# EAGLE design tfpcmcia (EAGLE 9.6.2)
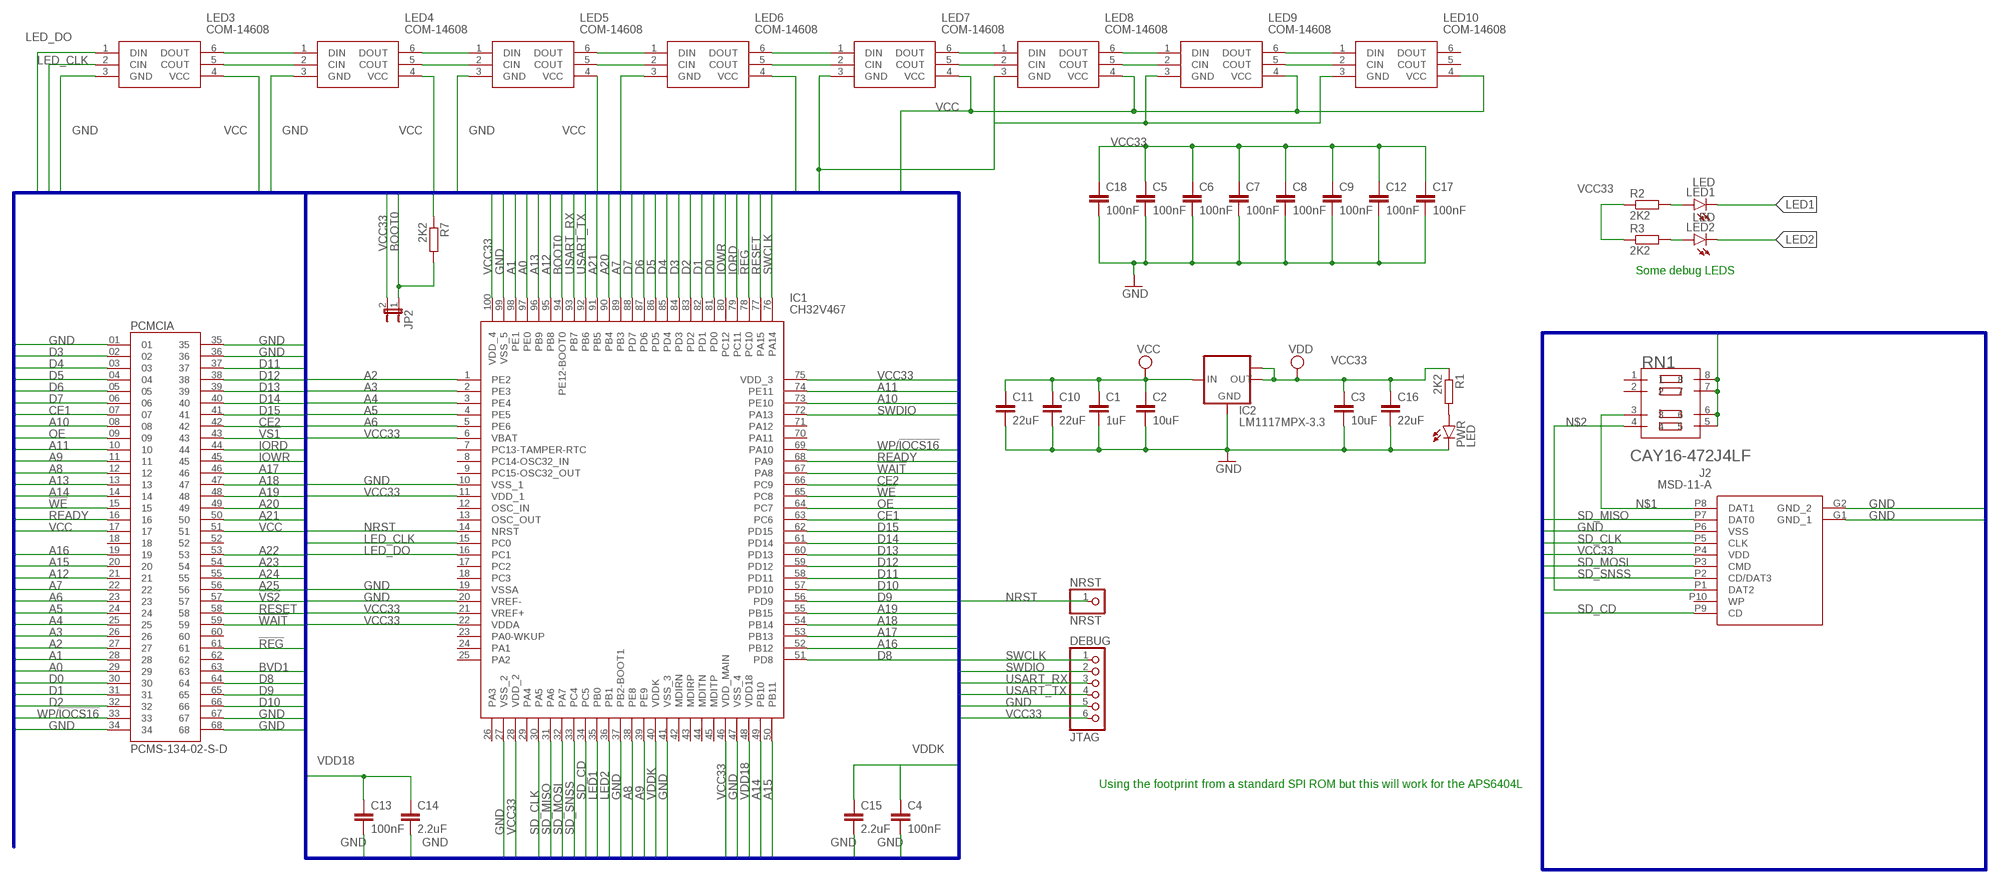
[diagram p0: schematic, sheet 1]

## Parts
C1  1uF  C-EUC1206  [C1206]
C2  10uF  CC0603  [C0603]
C3  10uF  C-EUC1206  [C1206]
C4  100nF  CC0603  [C0603]
C5  100nF  CC0603  [C0603]
C6  100nF  CC0603  [C0603]
C7  100nF  CC0603  [C0603]
C8  100nF  CC0603  [C0603]
C9  100nF  CC0603  [C0603]
C10  22uF  C-EUC1206  [C1206]
C11  22uF  C-EUC1206  [C1206]
C12  100nF  CC0603  [C0603]
C13  100nF  CC0603  [C0603]
C14  2.2uF  CC0603  [C0603]
C15  2.2uF  CC0603  [C0603]
C16  22uF  C-EUC1206  [C1206]
C17  100nF  CC0603  [C0603]
C18  100nF  CC0603  [C0603]
DEBUG  JTAG  HEADER-1X6ROUND  [1X06_ROUND]
IC1  CH32V467  CH32V467VET6  [QFP50P1600X1600X160-100N]
IC2  LM1117MPX-3.3  [SOT223]
J2  MSD-11-A  [MSD11A]
JP2  JUMPER-2PTH  [1X02]
LED1  LED  LEDSML0805  [SML0805]
LED2  LED  LEDSML0805  [SML0805]
LED3  COM-14608  [SON75P200X200X100-6N]
LED4  COM-14608  [SON75P200X200X100-6N]
LED5  COM-14608  [SON75P200X200X100-6N]
LED6  COM-14608  [SON75P200X200X100-6N]
LED7  COM-14608  [SON75P200X200X100-6N]
LED8  COM-14608  [SON75P200X200X100-6N]
LED9  COM-14608  [SON75P200X200X100-6N]
LED10  COM-14608  [SON75P200X200X100-6N]
NRST  NRST  PINHD-1X1  [1X01]
PCMCIA  PCMS-134-02-S-D  [SAMTEC_PCMS-134-02-S-D]
PWR  LED  LEDSML0805  [SML0805]
R1  2K2  R-EU_R0603  [R0603]
R2  2K2  R-EU_R0603  [R0603]
R3  2K2  R-EU_R0603  [R0603]
R7  2K2  R-EU_R0603  [R0603]
RN1  CAY16-472J4LF  CAY16-103J4LF  [RESCAXE80P320X160-8N]

## Nets
!REG: IC1.78(PC10) PCMCIA.61
!VS1: PCMCIA.43
!VS2: PCMCIA.57
!WAIT: IC1.67(PA8) PCMCIA.59
!WE: IC1.65(PC8) PCMCIA.15
A0: IC1.97(PE0) PCMCIA.29
A1: IC1.98(PE1) PCMCIA.28
A2: IC1.1(PE2) PCMCIA.27
A3: IC1.2(PE3) PCMCIA.26
A4: IC1.3(PE4) PCMCIA.25
A5: IC1.4(PE5) PCMCIA.24
A6: IC1.5(PE6) PCMCIA.23
A7: IC1.89(PB3) PCMCIA.22
A8: IC1.38(PE8) PCMCIA.12
A9: IC1.39(PE9) PCMCIA.11
A10: IC1.73(PE10) PCMCIA.08
A11: IC1.74(PE11) PCMCIA.10
A12: IC1.95(PB8) PCMCIA.21
A13: IC1.96(PB9) PCMCIA.13
A14: IC1.49(PB10) PCMCIA.14
A15: IC1.50(PB11) PCMCIA.20
A16: IC1.52(PB12) PCMCIA.19
A17: IC1.53(PB13) PCMCIA.46
A18: IC1.54(PB14) PCMCIA.47
A19: IC1.55(PB15) PCMCIA.48
A20: IC1.90(PB4) PCMCIA.49
A21: IC1.91(PB5) PCMCIA.50
A22: PCMCIA.53
A23: PCMCIA.54
A24: PCMCIA.55
A25: PCMCIA.56
BOOT0: IC1.94(PE12-BOOT0) JP2.1 R7.2
BVD1: PCMCIA.63
CE1: IC1.63(PC6) PCMCIA.07
CE2: IC1.66(PC9) PCMCIA.42
D0: IC1.81(PD0) PCMCIA.30
D1: IC1.82(PD1) PCMCIA.31
D2: IC1.83(PD2) PCMCIA.32
D3: IC1.84(PD3) PCMCIA.02
D4: IC1.85(PD4) PCMCIA.03
D5: IC1.86(PD5) PCMCIA.04
D6: IC1.87(PD6) PCMCIA.05
D7: IC1.88(PD7) PCMCIA.06
D8: IC1.51(PD8) PCMCIA.64
D9: IC1.56(PD9) PCMCIA.65
D10: IC1.57(PD10) PCMCIA.66
D11: IC1.58(PD11) PCMCIA.37
D12: IC1.59(PD12) PCMCIA.38
D13: IC1.60(PD13) PCMCIA.39
D14: IC1.61(PD14) PCMCIA.40
D15: IC1.62(PD15) PCMCIA.41
GND: C1.2 C2.2 C3.2 C4.2 C5.2 C6.2 C7.2 C8.2 C9.2 C10.2 C11.2 C12.2 C13.2 C14.2 C15.2 C16.2 C17.2 C18.2 DEBUG.5 IC1.10(VSS_1) IC1.19(VSSA) IC1.20(VREF-) IC1.27(VSS_2) IC1.37(PB2-BOOT1) IC1.41(VSS_3) IC1.47(VSS_4) IC1.99(VSS_5) IC2.1(GND) J2.G1(GND_1) J2.G2(GND_2) J2.P6(VSS) LED3.3(GND) LED4.3(GND) LED5.3(GND) LED6.3(GND) LED7.3(GND) LED8.3(GND) LED9.3(GND) LED10.3(GND) PCMCIA.01 PCMCIA.34 PCMCIA.35 PCMCIA.36 PCMCIA.67 PCMCIA.68 PWR.C R7.1
IORD: IC1.79(PC11) PCMCIA.44
IOWR: IC1.80(PC12) PCMCIA.45
LED1: IC1.35(PB0) LED1.C
LED2: IC1.36(PB1) LED2.C
LED_CLK: IC1.15(PC0) LED3.2(CIN)
LED_DO: IC1.16(PC1) LED3.1(DIN)
N$1: J2.P8(DAT1) RN1.3
N$2: J2.P1(DAT2) RN1.4
N$3: LED9.5(COUT) LED10.2(CIN)
N$4: LED9.6(DOUT) LED10.1(DIN)
N$5: LED1.A R2.2
N$6: LED2.A R3.2
N$11: LED4.5(COUT) LED5.2(CIN)
N$12: LED4.6(DOUT) LED5.1(DIN)
N$13: LED5.6(DOUT) LED6.1(DIN)
N$14: LED5.5(COUT) LED6.2(CIN)
N$15: LED3.5(COUT) LED4.2(CIN)
N$16: LED3.6(DOUT) LED4.1(DIN)
N$17: LED6.5(COUT) LED7.2(CIN)
N$18: PWR.A R1.2
N$19: LED6.6(DOUT) LED7.1(DIN)
N$20: LED7.6(DOUT) LED8.1(DIN)
N$21: LED7.5(COUT) LED8.2(CIN)
N$22: LED8.5(COUT) LED9.2(CIN)
N$23: LED8.6(DOUT) LED9.1(DIN)
NRST: IC1.14(NRST) NRST.1
OE: IC1.64(PC7) PCMCIA.09
READY: IC1.68(PA9) PCMCIA.16
RESET: IC1.77(PA15) PCMCIA.58
SD_CD: IC1.34(PC5) J2.P9(CD)
SD_CLK: IC1.30(PA5) J2.P5(CLK)
SD_MISO: IC1.31(PA6) J2.P7(DAT0)
SD_MOSI: IC1.32(PA7) J2.P3(CMD)
SD_SNSS: IC1.33(PC4) J2.P2(CD/DAT3)
SWCLK: DEBUG.1 IC1.76(PA14)
SWDIO: DEBUG.2 IC1.72(PA13)
USART_RX: DEBUG.3 IC1.93(PB7)
USART_TX: DEBUG.4 IC1.92(PB6)
VCC: C1.1 C2.1 C10.1 C11.1 IC2.3(IN) LED3.4(VCC) LED4.4(VCC) LED5.4(VCC) LED6.4(VCC) LED7.4(VCC) LED8.4(VCC) LED9.4(VCC) LED10.4(VCC) PCMCIA.17 PCMCIA.51
VCC33: C3.1 C5.1 C6.1 C7.1 C8.1 C9.1 C12.1 C16.1 C17.1 C18.1 DEBUG.6 IC1.6(VBAT) IC1.11(VDD_1) IC1.21(VREF+) IC1.22(VDDA) IC1.28(VDD_2) IC1.46(VDD_MAIN) IC1.75(VDD_3) IC1.100(VDD_4) IC2.2(OUT) IC2.TAB(OUT1) J2.P4(VDD) JP2.2 R1.1 R2.1 R3.1 RN1.5 RN1.6 RN1.7 RN1.8 ; supply symbol labelled VDD
VDD18: C13.1 C14.1 IC1.48(VDD18)
VDDK: C4.1 C15.1 IC1.40(VDDK)
WP/!IOCS16: IC1.69(PA10) PCMCIA.33
Unconnected: IC1.7(PC13-TAMPER-RTC) IC1.8(PC14-OSC32_IN) IC1.9(PC15-OSC32_OUT) IC1.12(OSC_IN) IC1.13(OSC_OUT) IC1.17(PC2) IC1.18(PC3) IC1.23(PA0-WKUP) IC1.24(PA1) IC1.25(PA2) IC1.26(PA3) IC1.29(PA4) IC1.42(MDIRN) IC1.43(MDIRP) IC1.44(MDITN) IC1.45(MDITP) IC1.70(PA11) IC1.71(PA12) J2.P10(WP) LED10.5(COUT) LED10.6(DOUT) PCMCIA.18 PCMCIA.52 PCMCIA.60 PCMCIA.62 RN1.1 RN1.2

## Buses
A[0..31],BVD[1..2],CD[1..2],CE[1..2],D[0..15],GND,IORD,IOWR,LED[1..3],LED_CLK,LED_DO,NRST,OE,RAM_CLK,RAM_MISO,RAM_MOSI,RAM_SNSS,READY,!REG,RESET,SD_CD,SD_CLK,SD_MISO,SD_MOSI,SD_SNSS,SWCLK,SWDIO,USART_RX,USART_TX,VCC,VCC33,!VS[1..2],!WAIT,!WE,WP/!IOCS16
AUD_MIXED,AUD_O,GND,SD_CD,SD_CLK,SD_MISO,SD_MOSI,SD_SNSS,VCC,VCC33
A[0..31],AUD_MIXED,AUD_O,BOOT0,BVD[1..2],CD[1..2],CE[1..2],D[0..15],GND,IORD,IOWR,LED[1..3],LED_CLK,LED_DO,NRST,OE,RAM_CLK,RAM_MISO,RAM_MOSI,RAM_SNSS,READY,!REG,RESET,SD_CD,SD_CLK,SD_MISO,SD_MOSI,SD_SNSS,SWCLK,SWDIO,USART_RX,USART_TX,USB1_DM,USB1_DP,VCC,VCC33,VDD18,VDDK,!VS[1..2],!WAIT,!WE,WP/!IOCS16

## Notes on the sheet
- Some debug LEDS
- Using the footprint from a standard SPI ROM but this will work for the APS6404L

## Library data of the parts
C1 C3 C10 C11 C16 = rcl:C-EU: CAPACITOR, European symbol; SPICEPREFIX: C
C2 C4-C9 C12-C15 C17 C18 = eagle-ltspice:C: CAPACITOR, European symbol; SPICEMODEL: NONE; SPICEPREFIX: C
DEBUG = microbuilder:HEADER-1X6: PIN HEADER
IC1 = SamacSys_Parts:CH32V467VET6: RISC-V QingKe 32-bit MCU, 200MHz, 992KB Flash, 200KB SRAM, 8MB on-chip PSRAM (mapped at 0x80000000), 2x USB2.0 HS, Ethernet MAC+PHY, FSMC, SDIO, 3x SPI, 10x USART Pin assignment from CH32V407/V467 Datasheet V1.2, Table 2-1 (CH32V467VET6 column). Note: PE7, PE13, PE14 and PE15 are NOT bonded out on this package. Pin 48 is VDD18 (on-chip PSRAM 1.8V rail, 0.1uF || 2.2uF). VDD_MAIN (pin 46) is the main VDD and needs 0.1uF || 10uF. Source: WCH <https://www.wch-ic.com/>; DESCRIPTION: RISC-V QingKe 32-bit MCU, 200MHz, 992KB Flash, 200KB SRAM, 8MB on-chip PSRAM (mapped at 0x80000000), 2x USB2.0 HS, Ethernet MAC+PHY, FSMC, SDIO, 3x SPI, 10x USART; HEIGHT: 1.6mm; MANUFACTURER_NAME: WCH; MANUFACTURER_PART_NUMBER: CH32V467VET6
IC2 = lm1117:LM1117MPX-*
J2 = SamacSys_Parts:MSD-11-A: Micro SD Card Connector, 8 Positions, Connector and Ejector, Push In, Auto Eject Out, Surface Mount, 1.85 mm Heaight Above Board, Gold Flash Source: Datasheet <https://www.sameskydevices.com/product/resource/msd-11-a.pdf>; DESCRIPTION: Micro SD Card Connector, 8 Positions, Connector and Ejector, Push In, Auto Eject Out, Surface Mount, 1.85 mm Heaight Above Board, Gold Flash; HEIGHT: 2.05mm; MANUFACTURER_NAME: Same Sky; MANUFACTURER_PART_NUMBER: MSD-11-A; MOUSER_PART_NUMBER: 179-MSD-11-A; MOUSER_PRICE-STOCK: https://www.mouser.co.uk/ProductDetail/Same-Sky/MSD-11-A?qs=Z%252BL2brAPG1Ik3z2e2QtVog%3D%3D
JP2 = SparkFun-Retired:JUMPER-2: Jumper Basic 0.1" spaced jumper. Use with breakaway headers.
LED1 LED2 PWR = led:LED: LED OSRAM: - CHIPLED LG R971, LG N971, LY N971, LG Q971, LY Q971, LO R971, LY R971 LH N974, LH R974 LS Q976, LO Q976, LY Q976 LO Q996 - Hyper CHIPLED LW Q18S LB Q993, LB Q99A, LB R99A - SideLED LS A670, LO A670, LY A670, LG A670, LP A670 LB A673, LV A673, LT A673, LW A673 LH A674 LY A675 LS A676, LA A676, LO A676, LY A676, LW A676 LS A679, LY A679, LG A679 - Hyper Micro SIDELED® LS Y876, LA Y876, LO Y876, LY Y876 LT Y87S - SmartLED LW L88C, LW L88S LB L89C, LB L89S, LG L890 LS L89K, LO L89K, LY L89K LS L896, LA L896, LO L896, LY L896 - TOPLED LS T670, LO T670, LY T670, LG T670, LP T670 LSG T670, LSP T670, LSY T670, LOP T670, LYG T670 LG T671, LOG T671, LSG T671 LB T673, LV T673, LT T673, LW T673 LH T674 LS T676, LA T676, LO T676, LY T676, LB T676, LH T676, LSB T676, LW T676 LB T67C, LV T67C, LT T67C, LS T67K, LO T67K, LY T67K, LW E67C LS E67B, LA E67B, LO E67B, LY E67B, LB E67C, LV E67C, LT E67C LW T67C LS T679, LY T679, LG T679 LS T770, LO T770, LY T770, LG T770, LP T770 LB T773, LV T773, LT T773, LW T773 LH T774 LS E675, LA E675, LY E675, LS T675 LS T776, LA T776, LO T776, LY T776, LB T776 LHGB T686 LT T68C, LB T68C - Hyper Mini TOPLED® LB M676 - Mini TOPLED Santana® LG M470 LS M47K, LO M47K, LY M47K Source: http://www.osram.convergy.de LUXEON: - LUMILED® LXK2-PW12-R00, LXK2-PW12-S00, LXK2-PW14-U00, LXK2-PW14-V00 LXK2-PM12-R00, LXK2-PM12-S00, LXK2-PM14-U00 LXK2-PE12-Q00, LXK2-PE12-R00, LXK2-PE12-S00, LXK2-PE14-T00, LXK2-PE14-U00 LXK2-PB12-K00, LXK2-PB12-L00, LXK2-PB12-M00, LXK2-PB14-N00, LXK2-PB14-P00, LXK2-PB14-Q00 LXK2-PR12-L00, LXK2-PR12-M00, LXK2-PR14-Q00, LXK2-PR14-R00 LXK2-PD12-Q00, LXK2-PD12-R00, LXK2-PD12-S00 LXK2-PH12-R00, LXK2-PH12-S00 LXK2-PL12-P00, LXK2-PL12-Q00, LXK2-PL12-R00 Source: www.luxeon.com KINGBRIGHT: KA-3528ASYC Source: www.kingbright.com
LED3-LED10 = Blinkenlights:COM-14608: SparkFun Accessories SMD LED - RGB APA102-2020 Source: Datasheet <https://componentsearchengine.com/Datasheets/1/COM-14608.pdf>; ARROW_PART_NUMBER: COM-14608; ARROW_PRICE-STOCK: https://www.arrow.com/en/products/com-14608/sparkfun-electronics?region=nac; DESCRIPTION: SparkFun Accessories SMD LED - RGB APA102-2020; HEIGHT: 1mm; MANUFACTURER_NAME: SparkFun; MANUFACTURER_PART_NUMBER: COM-14608; MOUSER_PART_NUMBER: 474-COM-14608; MOUSER_PRICE-STOCK: https://www.mouser.co.uk/ProductDetail/SparkFun/COM-14608?qs=r5DSvlrkXmJkrH4K3yuA0g%3D%3D
NRST = pinhead:PINHD-1X1: PIN HEADER
PCMCIA = PCMS-134-02-S-D:PCMS-134-02-S-D: Check availability <https://pricing.snapeda.com/parts/PCMS-134-02-S-D/Samtec/view-part?ref=eda>; AVAILABILITY: In Stock; CHECK_PRICES: https://www.snapeda.com/parts/PCMS-134-02-S-D/Samtec/view-part/?ref=eda; DESCRIPTION: Conn PCMCIA SKT 68 POS 1.27mm Solder ST Edge Mount 1A/Contact Tube; MF: Samtec; MP: PCMS-134-02-S-D; PACKAGE: None; PRICE: None; SNAPEDA_LINK: https://www.snapeda.com/parts/PCMS-134-02-S-D/Samtec/view-part/?ref=snap
R1-R3 R7 = rcl:R-EU_: RESISTOR, European symbol; SPICEPREFIX: R
RN1 = CAY16-103J4LF:CAY16-103J4LF: Res Thick Film Array 10K Ohm 5% 200ppm/C ISOL Molded 8-Pin 1206(4 X 0603) Convex SMD Paper T/R; AVAILABILITY: Good; DESCRIPTION: Res Thick Film Array 10K Ohm 5% ?200ppm/C ISOL Molded 8-Pin 1206(4 X 0603) Convex SMD Paper T/R; MF: Bourns; MP: CAY16-103J4LF; PACKAGE: 1206 Bourns; PRICE: 0.02 USD

## Board
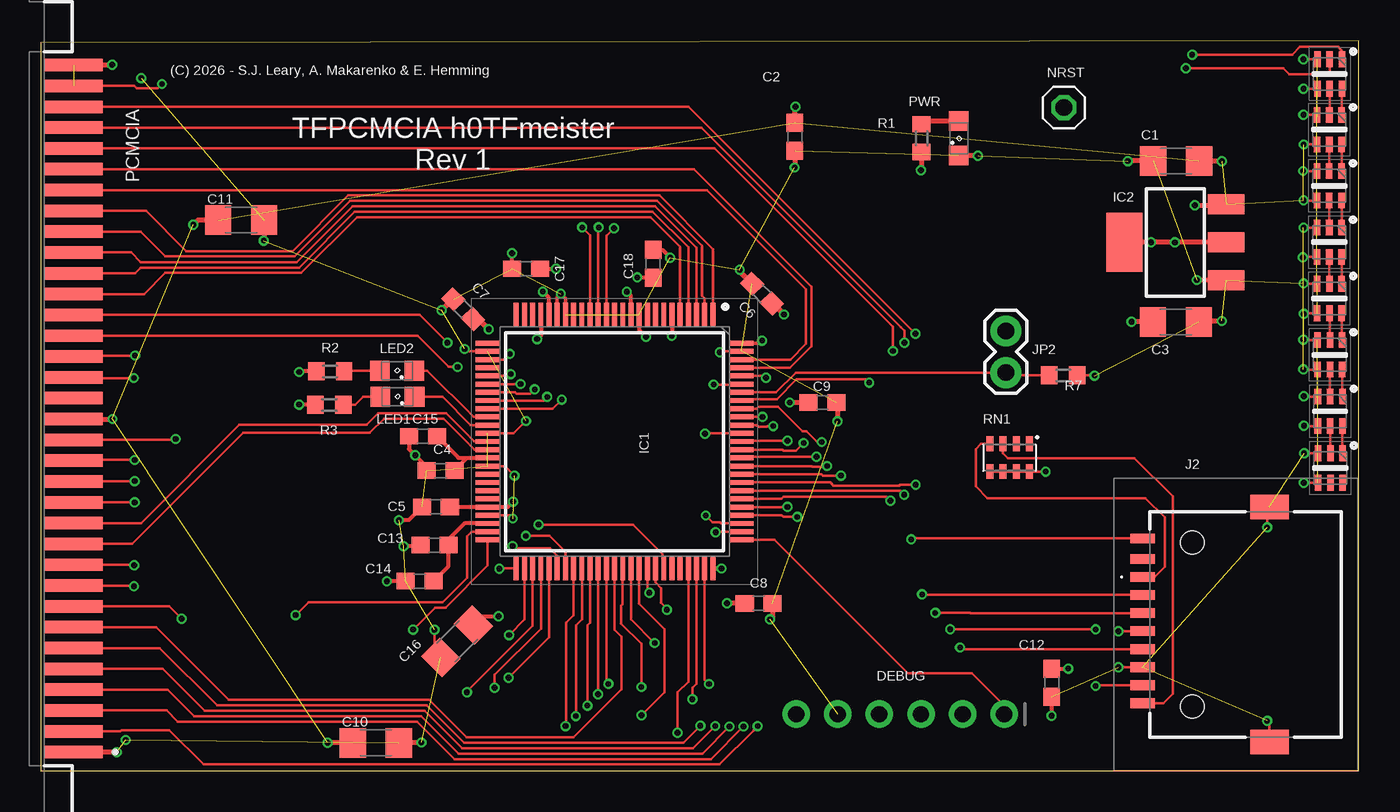
[diagram p1: board, top side]
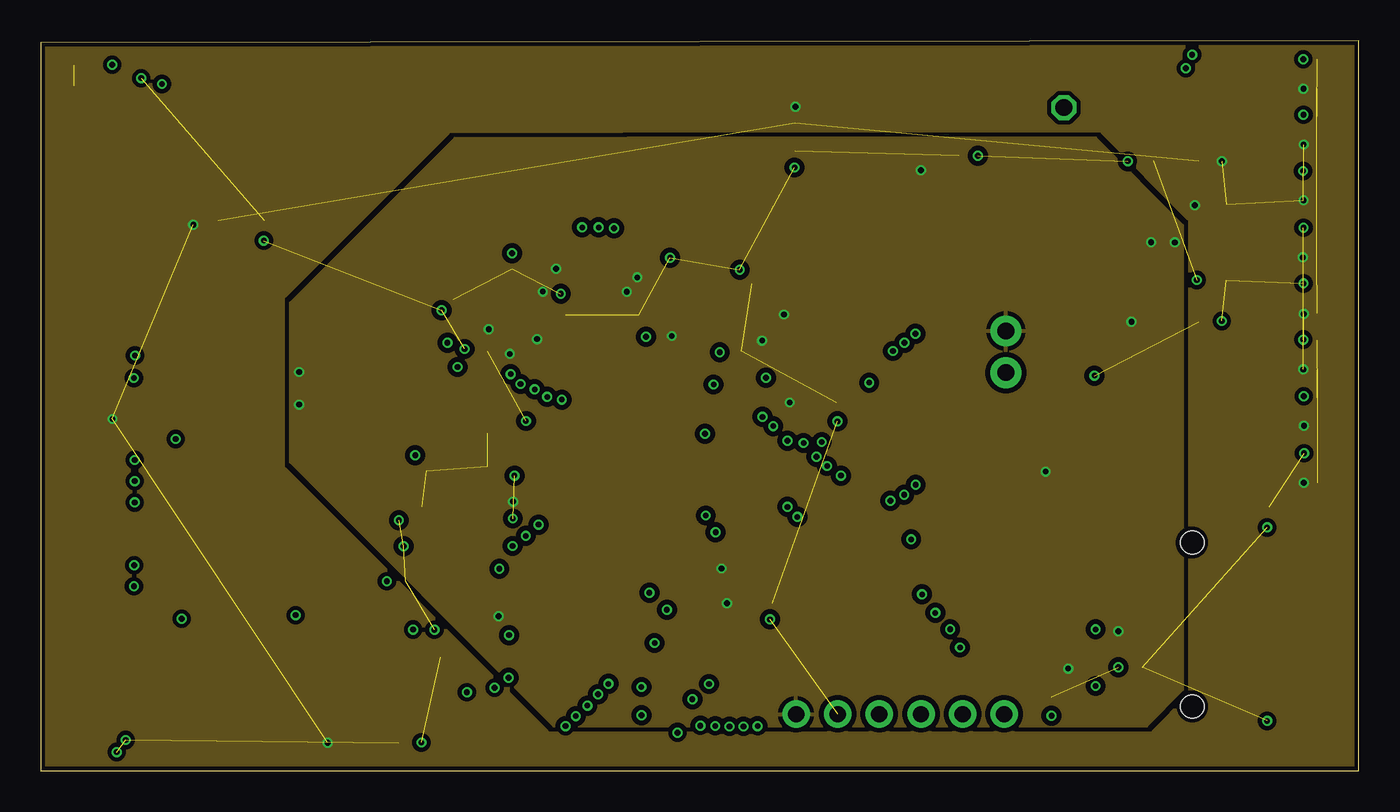
[diagram p2: board, inner layer PWR]
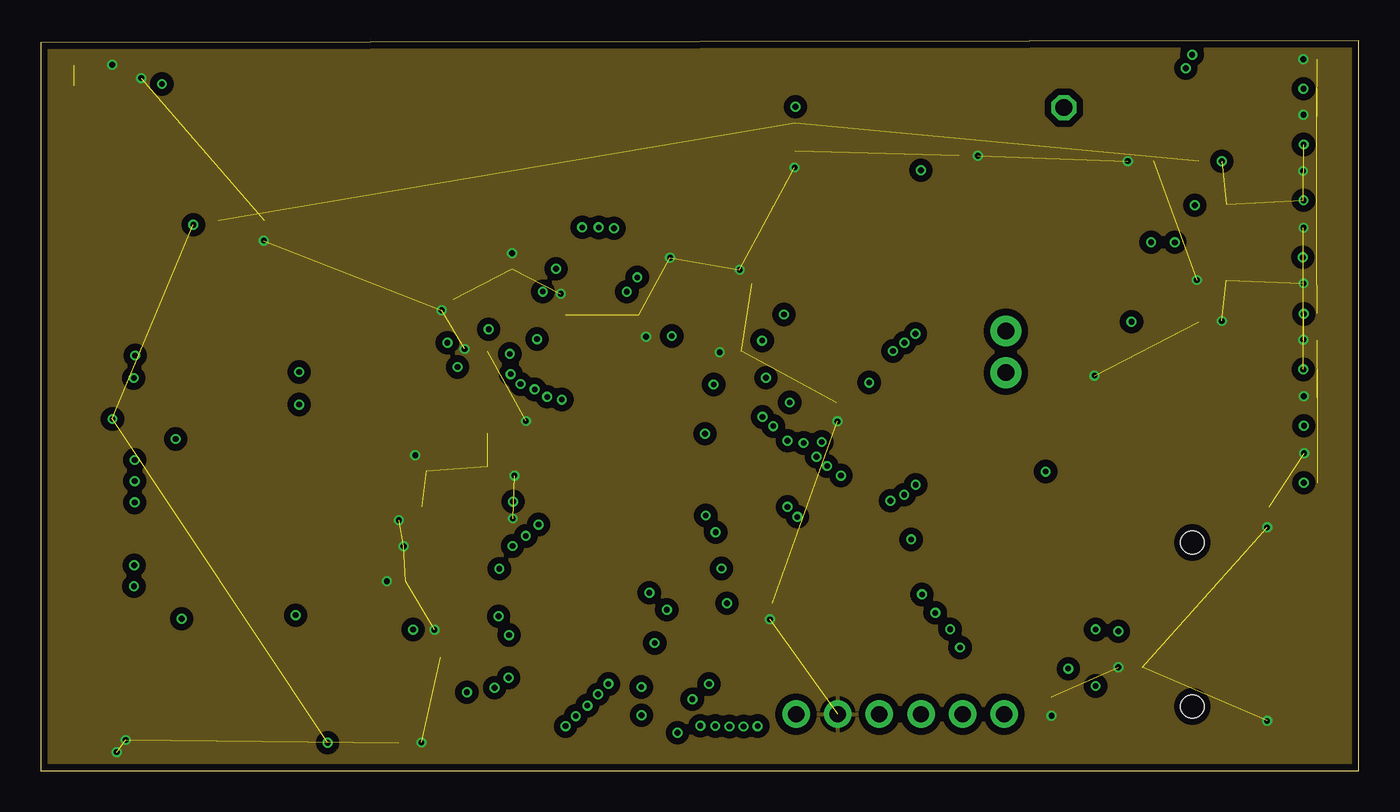
[diagram p3: board, inner layer GND]
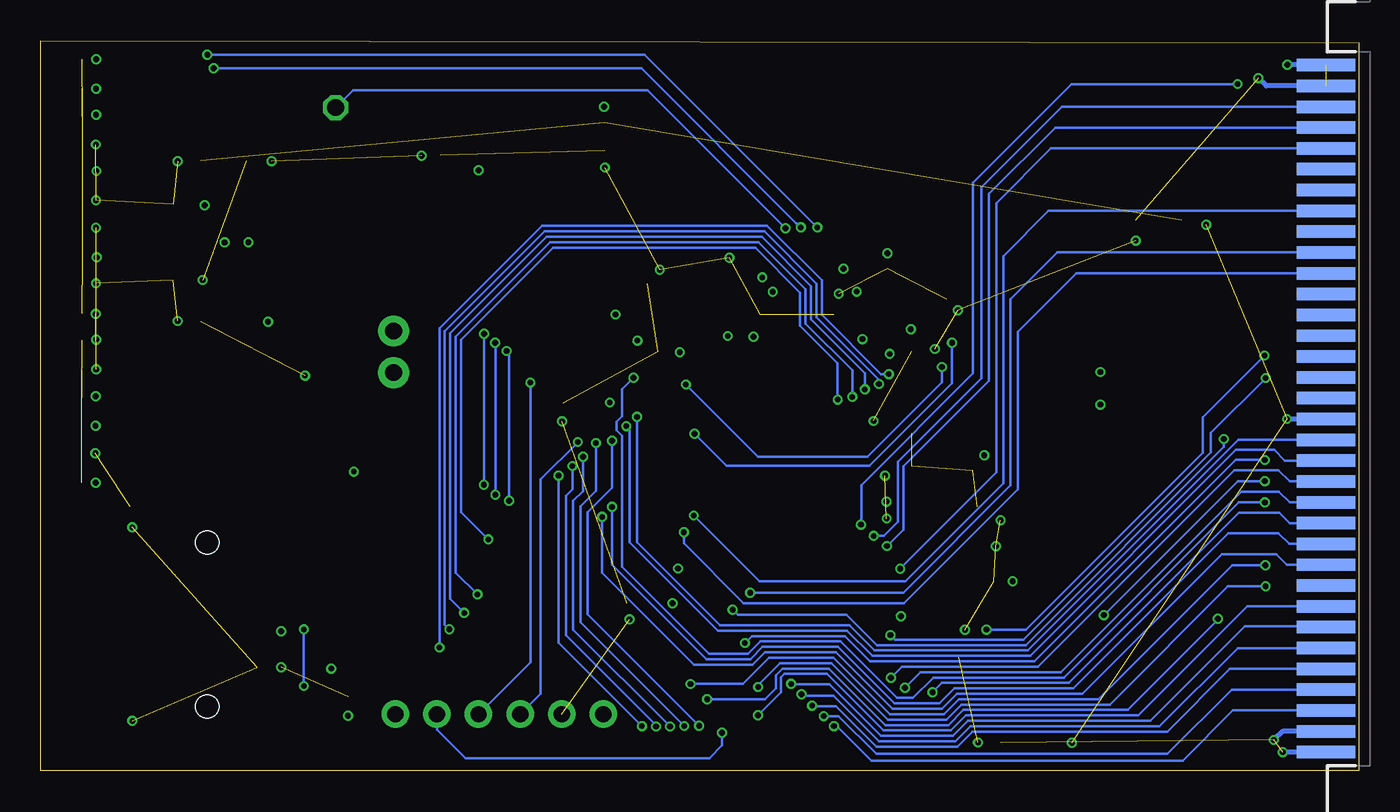
[diagram p4: board, bottom side, seen from below]

Size 80.41 x 44.52 mm. Coordinates in mm from the lower left corner, seen from the top.
Outline: 0,0 80.41,0 80.41,44.52 0,44.41 0,0
Copper layers (1*2*15*16): Top 0.035559375mm / dielectric 1.501140625mm / PWR 0.035559375mm / dielectric 0.149859375mm / GND 0.035559375mm / dielectric 0.200659375mm / Bottom 0.035559375mm
Design rules "jlcpcb-4layer *": minimum track width 5mil, minimum drill 0.2mm, track to track 7mil, track to pad 8mil, pad to pad 7mil, via to via 10mil, smd to smd 0mil, copper to edge 0.2mm, drill to drill 10mil, minimum pad ring 3mil, minimum via ring 5mil, stop-mask expansion 3mil, vias tented up to drill 0.2mm, thermal gap 10mil

### Footprints (pad centres in the part's own frame; a part is rotated, then mirrored left to right if it is on the bottom)
C1206 = smd 1.6 x 1.8: 1 -1.4,0; 2 1.4,0
C0603 = smd 1.1 x 1: 1 -0.85,0; 2 0.85,0
1X06_ROUND = drill 1 pad 1.676: 1 -6.35,0; 2 -3.81,0; 3 -1.27,0; 4 1.27,0; 5 3.81,0; 6 6.35,0
QFP50P1600X1600X160-100N = smd 1.475 x 0.3: 1 -7.738,6; 2 -7.738,5.5; 3 -7.738,5; 4 -7.738,4.5; 5 -7.738,4; 6 -7.738,3.5; 7 -7.738,3; 8 -7.738,2.5; 9 -7.738,2; 10 -7.738,1.5; 11 -7.738,1; 12 -7.738,0.5; 13 -7.738,0; 14 -7.738,-0.5; 15 -7.738,-1; 16 -7.738,-1.5; 17 -7.738,-2; 18 -7.738,-2.5; 19 -7.738,-3; 20 -7.738,-3.5; 21 -7.738,-4; 22 -7.738,-4.5; 23 -7.738,-5; 24 -7.738,-5.5; 25 -7.738,-6; 51 7.738,-6; 52 7.738,-5.5; 53 7.738,-5; 54 7.738,-4.5; 55 7.738,-4; 56 7.738,-3.5; 57 7.738,-3; 58 7.738,-2.5; 59 7.738,-2; 60 7.738,-1.5; 61 7.738,-1; 62 7.738,-0.5; 63 7.738,0; 64 7.738,0.5; 65 7.738,1; 66 7.738,1.5; 67 7.738,2; 68 7.738,2.5; 69 7.738,3; 70 7.738,3.5; 71 7.738,4; 72 7.738,4.5; 73 7.738,5; 74 7.738,5.5; 75 7.738,6 | smd 0.3 x 1.475: 26 -6,-7.738; 27 -5.5,-7.738; 28 -5,-7.738; 29 -4.5,-7.738; 30 -4,-7.738; 31 -3.5,-7.738; 32 -3,-7.738; 33 -2.5,-7.738; 34 -2,-7.738; 35 -1.5,-7.738; 36 -1,-7.738; 37 -0.5,-7.738; 38 0,-7.738; 39 0.5,-7.738; 40 1,-7.738; 41 1.5,-7.738; 42 2,-7.738; 43 2.5,-7.738; 44 3,-7.738; 45 3.5,-7.738; 46 4,-7.738; 47 4.5,-7.738; 48 5,-7.738; 49 5.5,-7.738; 50 6,-7.738; 76 6,7.738; 77 5.5,7.738; 78 5,7.738; 79 4.5,7.738; 80 4,7.738; 81 3.5,7.738; 82 3,7.738; 83 2.5,7.738; 84 2,7.738; 85 1.5,7.738; 86 1,7.738; 87 0.5,7.738; 88 0,7.738; 89 -0.5,7.738; 90 -1,7.738; 91 -1.5,7.738; 92 -2,7.738; 93 -2.5,7.738; 94 -3,7.738; 95 -3.5,7.738; 96 -4,7.738; 97 -4.5,7.738; 98 -5,7.738; 99 -5.5,7.738; 100 -6,7.738
SOT223 = smd 1.219 x 2.235: 1 -2.311,-3.099; 2 0,-3.099; 3 2.311,-3.099 | smd 3.6 x 2.2: TAB 0,3.099
MSD11A = smd 1.5 x 2.34: G1 7.17,-1.675; G2 -7.17,-1.675 | smd 0.6 x 1.5: P1 2.9,6.075; P2 1.8,6.075; P3 0.7,6.075; P4 -0.4,6.075; P5 -1.5,6.075; P6 -2.6,6.075; P7 -3.7,6.075; P8 -4.8,6.075; P9 5.25,6.075; P10 4,6.075 | hole 1.4: 5,3.025; -5,3.025
1X02 = drill 1.016 pad 1.88: 1 0,0; 2 2.54,0
SML0805 = smd 1.2 x 1.2: A 1.05,0; C -1.05,0
SON75P200X200X100-6N = smd 0.95 x 0.4: 1 -0.9,0.75; 2 -0.9,0; 3 -0.9,-0.75; 4 0.9,-0.75; 5 0.9,0; 6 0.9,0.75
1X01 = drill 1.016 octagon: 1 0,0
SAMTEC_PCMS-134-02-S-D = smd 0.762 x 3.556: 01 20.955,1.778; 02 19.685,1.778; 03 18.415,1.778; 04 17.145,1.778; 05 15.875,1.778; 06 14.605,1.778; 07 13.335,1.778; 08 12.065,1.778; 09 10.795,1.778; 10 9.525,1.778; 11 8.255,1.778; 12 6.985,1.778; 13 5.715,1.778; 14 4.445,1.778; 15 3.175,1.778; 16 1.905,1.778; 17 0.635,1.778; 18 -0.635,1.778; 19 -1.905,1.778; 20 -3.175,1.778; 21 -4.445,1.778; 22 -5.715,1.778; 23 -6.985,1.778; 24 -8.255,1.778; 25 -9.525,1.778; 26 -10.795,1.778; 27 -12.065,1.778; 28 -13.335,1.778; 29 -14.605,1.778; 30 -15.875,1.778; 31 -17.145,1.778; 32 -18.415,1.778; 33 -19.685,1.778; 34 -20.955,1.778 | smd 0.762 x 3.556 bottom: 35 20.955,1.778; 36 19.685,1.778; 37 18.415,1.778; 38 17.145,1.778; 39 15.875,1.778; 40 14.605,1.778; 41 13.335,1.778; 42 12.065,1.778; 43 10.795,1.778; 44 9.525,1.778; 45 8.255,1.778; 46 6.985,1.778; 47 5.715,1.778; 48 4.445,1.778; 49 3.175,1.778; 50 1.905,1.778; 51 0.635,1.778; 52 -0.635,1.778; 53 -1.905,1.778; 54 -3.175,1.778; 55 -4.445,1.778; 56 -5.715,1.778; 57 -6.985,1.778; 58 -8.255,1.778; 59 -9.525,1.778; 60 -10.795,1.778; 61 -12.065,1.778; 62 -13.335,1.778; 63 -14.605,1.778; 64 -15.875,1.778; 65 -17.145,1.778; 66 -18.415,1.778; 67 -19.685,1.778; 68 -20.955,1.778
R0603 = smd 1 x 1.1: 1 -0.85,0; 2 0.85,0
RESCAXE80P320X160-8N = smd 0.9 x 0.425: 1 -0.85,1.2; 2 -0.85,0.4; 3 -0.85,-0.4; 4 -0.85,-1.2; 5 0.85,-1.2; 6 0.85,-0.4; 7 0.85,0.4; 8 0.85,1.2

### Placement (x,y rotation side)
C1  69.27,37.19 180 top
C2  46,38.66 270 top
C3  69.26,27.38 0 top
C4  24.39,18.31 180 top
C5  24.1,16.1 180 top
C6  44,29.11 135 top
C7  25.76,28.15 135 top
C8  43.8,10.2 0 top
C9  47.7,22.45 0 top
C10  20.44,1.7 0 top
C11  12.22,33.59 0 top
C12  61.67,5.36 270 top
C13  24.02,13.76 180 top
C14  23.11,11.56 180 top
C15  23.31,20.4 180 top
C16  25.39,7.9 225 top
C17  29.6,30.62 180 top
C18  37.37,30.92 90 top
DEBUG  52.43,3.44 180 top
IC1  35.01,20.08 270 top
IC2  69.23,32.23 90 top
J2  73.29,8.92 90 top
JP2  58.88,24.28 90 top
LED1  21.73,24.39 180 top
LED2  21.76,22.81 180 top
LED3  78.64,42.5 270 top
LED4  78.62,39.1 270 top
LED5  78.62,35.68 270 top
LED6  78.62,32.24 270 top
LED7  78.63,28.81 270 top
LED8  78.66,25.37 270 top
LED9  78.67,21.93 270 top
LED10  78.69,18.46 270 top
NRST  62.43,40.45 0 top
PCMCIA  0.21,22.09 270 top
PWR  56.01,38.58 90 top
R1  53.74,38.58 90 top
R2  17.65,24.36 0 top
R3  17.6,22.31 0 top
R7  62.39,24.12 180 top
RN1  59.11,19.1 270 top

### Tracks (layer width: path | path; a pad name or v marks a point on that pad's centre or on a via)
!REG  (via drill 0.35)
  Top 0.152: IC1.78 41.51,15.08 41.43,15.16 40.98,15.16 v40.57,15.57
  Bottom 0.152: PCMCIA.61 18.91,34.15 21.68,31.38 21.68,17.53 27.66,11.55 36.55,11.55 v40.57,15.57
!WAIT  (via drill 0.35)
  Top 0.152: IC1.67 37.01,10.98 v37.13,10.86
  Bottom 0.152: PCMCIA.59 18.38,31.61 21.23,28.75 21.23,17.41 27.78,10.86 v37.13,10.86
!WE  (via drill 0.35)
  Top 0.152: PCMCIA.15 2.03,18.95 v5.72,18.95 | IC1.65 36.01,9.23 v37.45,7.79
  Bottom 0.152: v5.72,18.95 7.5,18.95 19.78,6.67 29.81,6.67 31.35,8.21 37.03,8.21 v37.45,7.79
A0
  Top 0.152: IC1.97 45.7,24.58 47.02,25.9 47.02,29.52 39.85,36.69 PCMCIA.29
A1
  Top 0.152: IC1.98 45.74,25.08 46.69,26.03 46.69,29.38 40.65,35.42 PCMCIA.28
A2
  Top 0.152: PCMCIA.27 6.42,34.15 8.87,31.7 15.35,31.7 18.74,35.09 37.73,35.09 41.01,31.82 IC1.1
A3
  Top 0.152: IC1.2 40.51,28.81 40.34,28.98 40.34,32.02 37.6,34.76 18.88,34.76 15.49,31.37 7.59,31.37 6.07,32.88 PCMCIA.26
A4
  Top 0.152: PCMCIA.25 5.5,31.61 6.09,31.02 15.61,31.02 19.02,34.43 37.46,34.43 40.01,31.89 IC1.3
A5
  Top 0.152: PCMCIA.24 5.75,30.34 6.09,30.69 15.74,30.69 19.15,34.1 37.32,34.1 39.51,31.92 IC1.4
A6
  Top 0.152: PCMCIA.23 6.3,29.07 7.58,30.36 15.88,30.36 19.29,33.77 37.19,33.77 39.01,31.95 IC1.5
A7  (via drill 0.35)
  Top 0.152: v24.8,26.1 23.1,27.8 PCMCIA.22 | v40.53,20.56 40.55,20.58 IC1.89
  Bottom 0.152: v40.53,20.56 38.57,18.61 29.84,18.61 24.8,23.64 v24.8,26.1
A8
  Top 0.152: PCMCIA.12 6.11,15.1 12.11,21.11 19.87,21.11 20.57,21.81 24.72,21.81 26.44,20.08 IC1.38
A9
  Top 0.152: PCMCIA.11 5.57,13.83 12.35,20.6 20.06,20.6 20.93,21.48 24.57,21.48 26.47,19.58 IC1.39
A10  (via drill 0.35)
  Top 0.152: v39.75,4.36 39.75,5.06 40.01,5.32 IC1.73 | PCMCIA.08 7.83,10.02 v8.59,9.26
  Bottom 0.152: v8.59,9.26 8.59,9.2 14.09,3.7 24.11,3.7 25.02,2.78 28.86,2.78 32.31,6.23 35.16,6.23 35.57,5.83 35.57,5.02 36.23,4.36 v39.75,4.36
A11  (via drill 0.35)
  Top 0.152: PCMCIA.10 5.65,12.56 v5.68,12.53 | v40.77,5.29 40.51,5.55 IC1.74
  Bottom 0.152: v5.68,12.53 7.7,12.53 15.87,4.36 24.38,4.36 25.3,3.44 28.59,3.44 32.03,6.89 35.97,6.89 37.57,5.29 v40.77,5.29
A12  (via drill 0.35)
  Top 0.152: v41.05,23.56 42.72,23.56 IC1.95 | PCMCIA.21 22.98,26.53 24.89,24.63 v25.42,24.63
  Bottom 0.152: v41.05,23.56 36.65,19.16 29.96,19.16 25.42,23.7 v25.42,24.63
A13  (via drill 0.35)
  Top 0.152: v5.71,16.37 PCMCIA.13 | IC1.96 44.14,24.08 v44.25,23.97
  Bottom 0.152: v5.71,16.37 7.3,16.37 17.98,5.68 25.96,5.68 27.21,4.43 28.18,4.43 31.62,7.88 36.5,7.88 37.25,7.13 39.64,7.13 44.95,12.44 44.95,13.45 44.95,20.43 45.29,20.77 45.29,21.27 44.95,21.62 44.95,23.28 v44.25,23.97
A14  (via drill 0.35)
  Top 0.152: PCMCIA.14 5.72,17.64 v5.71,17.66 | IC1.49 26.28,14.58 26,14.3 26,11.77 24.51,10.28 16.33,10.28 v15.54,9.49
  Bottom 0.152: v15.54,9.49 7.37,17.66 v5.71,17.66
A15  (via drill 0.35)
  Top 0.152: PCMCIA.20 2.06,25.33 v5.74,25.33 | IC1.50 27.27,12.54 24.68,9.95 24.06,9.95 v22.71,8.61
  Bottom 0.152: v22.71,8.61 20.31,8.61 9.5,19.41 9.5,21.57 v5.74,25.33
A16  (via drill 0.35)
  Top 0.152: PCMCIA.19 2.03,23.95 v5.67,23.95 | IC1.52 29.52,9.22 v28.56,8.27
  Bottom 0.152: v5.67,23.95 9.01,20.61 9.01,19.43 20.45,7.99 28.29,7.99 v28.56,8.27
A17  (via drill 0.35)
  Top 0.152: IC1.53 30.01,8.86 26,4.85 v26,4.79
  Bottom 0.152: PCMCIA.46 4.19,15.1 4.84,15.74 7.3,15.74 17.69,5.35 25.43,5.35 v26,4.79
A18  (via drill 0.35)
  Top 0.152: v27.68,5.06 27.68,5.84 30.51,8.66 IC1.54
  Bottom 0.152: PCMCIA.47 4.21,16.37 4.86,17.02 7.15,17.02 18.16,6.01 26.73,6.01 v27.68,5.06
A19  (via drill 0.35)
  Top 0.152: IC1.55 31.01,8.14 v28.54,5.67
  Bottom 0.152: PCMCIA.48 4.2,17.64 4.89,18.33 7.59,18.33 19.57,6.34 27.86,6.34 v28.54,5.67
A20  (via drill 0.35)
  Top 0.152: IC1.90 43.68,21.08 43.78,20.98 44.28,20.98 44.33,21.02 v44.69,21.02
  Bottom 0.152: PCMCIA.49 4.5,18.91 5.16,19.57 7.47,19.57 20.04,7 29.67,7 31.21,8.54 39.1,8.54 44.48,13.93 44.48,20.82 v44.69,21.02
A21  (via drill 0.35)
  Top 0.152: IC1.91 v44.03,21.58
  Bottom 0.152: PCMCIA.50 7.33,20.18 20.18,7.33 29.54,7.33 31.07,8.87 38.96,8.87 44.03,13.94 v44.03,21.58
BOOT0
  Top 0.152: R7.2 59.05,24.12 JP2.1 46.07,24.28 44.87,23.08 IC1.94
CE1
  Top 0.152: PCMCIA.07 7.03,8.75 11.46,4.31 23.68,4.31 25.97,2.03 32.5,2.03 35.42,4.95 35.42,8.17 35.01,8.59 IC1.63
CE2  (via drill 0.35)
  Top 0.152: IC1.66 36.51,10.17 38.06,8.62 38.06,4.79 v36.65,3.38
  Bottom 0.152: PCMCIA.42 6.79,10.02 13.44,3.37 23.97,3.37 24.89,2.45 29,2.45 32.44,5.9 35.03,5.9 35.24,5.69 35.24,4.79 v36.65,3.38
D0  (via drill 0.35)
  Top 0.152: PCMCIA.30 41.1,37.96 51.99,27.08 v51.99,25.6 | IC1.81 45.19,16.58 45.3,16.7 51.6,16.7 v51.84,16.46
  Bottom 0.152: v51.84,16.46 51.84,25.45 v51.99,25.6
D1  (via drill 0.35)
  Top 0.152: PCMCIA.31 40.3,39.23 52.49,27.04 52.7,26.84 v52.7,26.11 | IC1.82 48.2,17.08 48.22,17.07 52.44,17.07 v52.68,16.83
  Bottom 0.152: v52.68,16.83 52.68,26.09 v52.7,26.11
D2  (via drill 0.35)
  Top 0.152: PCMCIA.32 39.52,40.5 v53.37,26.65 | IC1.83 48.17,17.58 48.35,17.4 52.39,17.4 52.44,17.44 v53.38,17.44
  Bottom 0.152: v53.38,17.44 v53.38,26.64 v53.37,26.65
D3  (via drill 0.35)
  Top 0.152: PCMCIA.02 4.84,2.4 4.92,2.48 7.83,2.48 9.93,0.38 41.42,0.38 43.49,2.44 43.49,2.47 v43.74,2.72 | IC1.84 47.62,18.08 47.72,17.98 48.81,17.98 v48.83,18
  Bottom 0.152: v48.83,18 48.83,7.81 v43.74,2.72
D4  (via drill 0.35)
  Top 0.152: PCMCIA.03 7.67,3.67 8.35,2.99 22.97,2.99 25.25,0.71 40.9,0.71 v42.88,2.69 | IC1.85 47.05,18.58 47.08,18.55 47.94,18.55 v47.98,18.59
  Bottom 0.152: v42.88,2.69 42.88,2.78 48.35,8.25 48.35,16.78 47.98,17.16 v47.98,18.59
D5  (via drill 0.35)
  Top 0.152: PCMCIA.04 7.72,4.94 9.34,3.32 23.2,3.32 25.48,1.04 40.37,1.04 v42.02,2.69 | IC1.86 42.81,19.15 43.6,19.15 43.6,19.16 v47.33,19.16
  Bottom 0.152: v47.33,19.16 47.33,17.05 47.93,16.45 47.93,8.6 v42.02,2.69
D6  (via drill 0.35)
  Top 0.152: PCMCIA.05 7.43,6.21 9.99,3.65 23.41,3.65 25.69,1.37 39.8,1.37 v41.15,2.73 | IC1.87 45.24,19.58 45.3,19.52 46.07,19.52 v46.54,19.99
  Bottom 0.152: v41.15,2.73 47.49,9.07 47.49,16.14 46.54,17.09 v46.54,19.99
D7  (via drill 0.35)
  Top 0.152: PCMCIA.06 7.26,7.48 10.76,3.98 23.55,3.98 25.83,1.7 39.2,1.7 v40.24,2.74 | IC1.88 42.79,20.12 v45.55,20.12
  Bottom 0.152: v45.55,20.12 45.55,17.27 47.05,15.78 47.05,9.55 v40.24,2.74
D8  (via drill 0.35)
  Top 0.152: v27.97,12.32 28,12.34 IC1.51
  Bottom 0.152: PCMCIA.64 18.77,37.96 22.11,34.62 22.11,18.19 v27.97,12.33 v27.97,12.32
D9  (via drill 0.35)
  Top 0.152: v28.78,13.7 28.92,13.56 31.07,13.56 31.51,13.12 IC1.56
  Bottom 0.152: PCMCIA.65 18.51,39.23 22.55,35.19 22.55,26.25 22.55,23.79 27.77,18.57 27.77,14.71 v28.78,13.7
D10  (via drill 0.35)
  Top 0.152: v29.59,14.32 31.03,14.32 32.01,13.35 IC1.57
  Bottom 0.152: v29.59,14.32 28.97,14.32 28.1,15.19 28.1,18.86 23.01,23.95 23.01,29.43 23.01,35.6 18.1,40.5 PCMCIA.66
D11  (via drill 0.35)
  Top 0.152: IC1.58 32.51,9.47 32.04,9.01 32.04,3.59 32.03,3.58 32.03,2.74 v32.01,2.72
  Bottom 0.152: PCMCIA.37 7.67,3.67 10.73,0.61 29.73,0.61 31.84,2.72 v32.01,2.72
D12  (via drill 0.35)
  Top 0.152: v32.64,3.33 32.64,8.86 33.01,9.23 IC1.59
  Bottom 0.152: v32.64,3.33 31.74,3.33 29.44,1.02 11.67,1.02 7.75,4.94 PCMCIA.38
D13  (via drill 0.35)
  Top 0.152: IC1.60 33.51,9.04 33.34,8.87 33.34,8.37 v33.34,3.97
  Bottom 0.152: PCMCIA.39 7.84,6.21 11.68,2.38 23.56,2.38 24.48,1.46 29.41,1.46 31.88,3.94 33.31,3.94 v33.34,3.97
D14  (via drill 0.35)
  Top 0.152: v33.99,4.66 34.01,4.68 IC1.61
  Bottom 0.152: PCMCIA.40 7.38,7.48 12.15,2.71 23.7,2.71 24.61,1.79 29.27,1.79 32.05,4.58 33.9,4.58 v33.99,4.66
D15  (via drill 0.35)
  Top 0.152: v34.63,5.29 34.51,5.42 IC1.62
  Bottom 0.152: PCMCIA.41 2.05,8.81 6.93,8.81 12.7,3.04 23.83,3.04 24.75,2.12 29.13,2.12 32.28,5.27 34.61,5.27 v34.63,5.29
GND  (via drill 0.35)  (42 unrouted)
  Top 0.152: J2.P6 v65.76,6.32 v65.75,6.31 | J2.G1 74.83,15.95 v74.83,14.84 | J2.G2 74.97,2.9 v74.83,3.04 | IC1.99 41.48,25.58 v41.42,25.52 | LED3.3 v77.04,43.4 v77.04,43.41 | LED4.3 77.06,40 v77.05,40.02 | LED5.3 v77.03,36.58 v77.02,36.58 | LED6.3 77.84,33.11 v77.05,33.11 | LED7.3 77.07,29.71 v77.05,29.73 | LED8.3 77.06,26.27 v77.03,26.3 | LED9.3 77.07,22.83 v77.06,22.84 | IC1.47 28.6,15.58 v28.8,15.38 | IC1.27 25.99,25.58 v25.85,25.73 | R7.1 64.28,24.12 v64.3,24.1 | LED10.3 v77.09,19.36 v77.08,19.36 | IC1.41 28.31,18.58 v28.89,18 | C16.2 24.01,7.3 v24.01,8.6 | IC1.37 28.84,20.58 v29.59,21.33
  Top 0.203: IC1.20 31.51,28.87 v31.72,29.09 32.01,28.81 IC1.19
  Top 0.254: IC1.10 36.51,26.89 v36.92,26.47 | C12.2 v61.67,3.36 v61.67,3.35 | C17.2 v28.75,31.55 v28.75,31.56 | C18.2 37.93,31.77 v38.4,31.3 | C13.2 23.11,13.7 v22.13,13.7 | C14.2 v21.11,11.56 | C15.2 22.46,19.62 v22.84,19.24 23.54,18.54 C4.2 | C5.2 22.44,15.28 v21.84,15.28
  Top 0.305: PCMCIA.68 2.02,43.07 v4.35,43.07 | v4.62,1.13 PCMCIA.35 | PCMCIA.35 | C1.2 v66.33,37.19 | IC2.1 70.56,29.92 v70.54,29.93 | C11.2 13.62,32.35 v13.6,32.34 | C7.2 25.12,28.75 v24.45,28.08 | C9.2 48.61,22.39 v48.61,21.3 | C6.2 42.64,30.47 v42.64,30.57 | C3.2 70.71,27.43 v72.06,27.43 | C2.2 46,36.8 v45.99,36.79 | PWR.C 57.15,37.53 v57.17,37.52 | C10.2 21.87,1.72 v23.22,1.72 | C8.2 44.65,9.38 v44.49,9.22
  Bottom 0.305: PCMCIA.67 5.64,41.77 v6.11,42.25 | PCMCIA.35 v4.62,1.13 | v4.62,1.13 | PCMCIA.36 4.64,2.4 v5.17,1.87 | PCMCIA.68 2.02,43.07 v4.35,43.07
  pour GND (isolate 0.406): 0,44.52 0,0 80.41,0 80.41,44.52
IORD  (via drill 0.35)
  Top 0.152: IC1.79 45.2,15.58 45.3,15.48 45.8,15.48 | 45.8,15.48 | 45.8,15.48 v46.16,15.48
  Bottom 0.152: PCMCIA.44 4.37,12.56 5.02,13.21 8.35,13.21 16.86,4.69 24.52,4.69 25.43,3.77 28.45,3.77 31.89,7.22 36.23,7.22 36.97,6.47 40.55,6.47 46.16,12.08 v46.16,15.48
IOWR  (via drill 0.35)
  Top 0.152: IC1.80 v45.54,16.08 v45.55,16.09
  Bottom 0.152: PCMCIA.45 4.22,13.83 4.88,14.49 7.94,14.49 17.41,5.02 24.65,5.02 25.57,4.1 28.31,4.1 31.76,7.55 36.36,7.55 37.11,6.8 39.78,6.8 45.55,12.57 v45.55,16.09
LED1
  Top 0.152: IC1.35 26.39,21.58 23.57,24.39 LED1.C
LED2
  Top 0.152: IC1.36 26.22,21.08 24.5,22.81 LED2.C
LED_CLK  (via drill 0.35)
  Top 0.152: IC1.15 34.01,33.11 v34.04,33.14 | LED3.2 78.64,42.64 78.49,42.49 76.17,42.49 75.81,42.85 v69.87,42.85
  Bottom 0.152: v34.04,33.14 34.3,33.41 34.32,33.41 43.76,42.85 v69.87,42.85
LED_DO  (via drill 0.35)
  Top 0.152: IC1.16 33.51,32.67 v33.03,33.14 | LED3.1 79.39,43.93 79.16,44.16 76.84,44.16 76.36,43.68 v70.25,43.68
  Bottom 0.152: v33.03,33.14 33.22,33.33 43.57,43.68 v70.25,43.68
N$1
  Top 0.152: RN1.3 58.71,19.35 59,19.07 66.73,19.07 69.07,16.73 69.07,4.69 68.5,4.12 J2.P8
N$2
  Top 0.152: RN1.4 57.37,19.95 57.04,19.62 57.04,17.36 57.77,16.63 67.4,16.63 68.59,15.45 68.59,12.43 67.97,11.82 J2.P1
N$3
  Top 0.152: LED9.5 78.69,21.01 LED10.2
N$4
  Top 0.152: LED9.6 79.42,19.38 LED10.1
N$5
  Top 0.152: R2.2 18.54,24.39 LED1.A
N$6
  Top 0.152: LED2.A 19.67,22.81 19.17,22.31 R3.2
N$11
  Top 0.152: LED4.5 LED5.2
N$12
  Top 0.152: LED4.6 LED5.1
N$13
  Top 0.152: LED5.6 LED6.1
N$14
  Top 0.152: LED5.5 LED6.2
N$15
  Top 0.152: LED3.5 78.64,40.02 LED4.2
N$16
  Top 0.152: LED3.6 79.39,40.02 LED4.1
N$17
  Top 0.152: LED6.5 LED7.2
N$18
  Top 0.305: R1.2 53.94,39.63 PWR.A
N$19
  Top 0.152: LED6.6 LED7.1
N$20
  Top 0.152: LED7.6 79.38,26.29 LED8.1
N$21
  Top 0.152: LED8.2 78.66,27.88 LED7.5
N$22
  Top 0.152: LED9.2 78.66,22.84 LED8.5
N$23
  Top 0.152: LED9.1 79.42,24.45 LED8.6
NRST  (via drill 0.35)
  Top 0.152: IC1.14 34.51,32.62 v34.97,33.09
  Bottom 0.152: v34.97,33.09 43.4,41.52 61.36,41.52 NRST.1
OE  (via drill 0.35)
  Top 0.152: PCMCIA.09 5.63,11.29 v5.67,11.25 | IC1.64 35.51,10.15 35.41,10.06 35.41,8.97 36.64,7.75 v36.64,5.1
  Bottom 0.152: v5.67,11.25 7.97,11.25 15.19,4.03 24.24,4.03 25.16,3.11 28.72,3.11 32.17,6.56 35.3,6.56 36.64,5.22 v36.64,5.1
READY  (via drill 0.35)
  Top 0.152: v8.22,20.23 8.17,20.18 PCMCIA.16 | v38.2,9.82 38.2,9.9 37.85,10.25 37.85,11.14 37.51,11.48 IC1.68
  Bottom 0.152: v8.22,20.23 8.22,19.76 20.31,7.66 29.4,7.66 31.24,9.5 37.88,9.5 v38.2,9.82
RESET  (via drill 0.35)
  Top 0.152: v41.18,14.55 41.2,14.58 IC1.77
  Bottom 0.152: PCMCIA.58 17.23,30.34 20.8,26.77 20.8,17.18 27.76,10.23 37.54,10.23 41.18,13.87 v41.18,14.55
SD_CD  (via drill 0.35)
  Top 0.152: J2.P9 53.17,14.17 v53.11,14.11 | IC1.34 31.23,22.08 v31.79,22.64
  Bottom 0.152: v31.79,22.64 31.79,24.85 34.07,27.14 34.07,29.16 36.81,31.9 49.15,31.9 54.77,26.28 54.77,15.77 v53.11,14.11
SD_CLK  (via drill 0.35)
  Top 0.152: IC1.30 28.55,24.08 v28.67,24.19 | v56.09,7.51 56.19,7.42 J2.P5
  Bottom 0.152: v28.67,24.19 29.14,24.19 32.75,27.8 32.75,29.91 36.1,33.25 49.83,33.25 56.09,27 v56.09,7.51
SD_MISO  (via drill 0.35)
  Top 0.152: J2.P7 64.42,5.22 v64.36,5.16 | IC1.31 29.27,23.58 v29.28,23.59 | v55.49,8.63 55.5,8.62 v64.36,8.62
  Bottom 0.152: v64.36,5.16 v64.36,8.62 | v55.49,8.63 55.76,8.91 55.76,26.81 49.68,32.89 36.26,32.89 33.08,29.72 33.08,27.66 29.28,23.86 v29.28,23.59
SD_MOSI  (via drill 0.35)
  Top 0.152: J2.P3 56.71,9.62 56.7,9.63 v54.58,9.63 | IC1.32 28.93,23.08 29.02,22.98 29.86,22.98 v30.13,23.26
  Bottom 0.152: v54.58,9.63 55.43,10.48 55.43,26.67 49.54,32.56 36.42,32.56 33.41,29.56 33.41,27.53 30.13,24.25 v30.13,23.26
SD_SNSS  (via drill 0.35)
  Top 0.152: IC1.33 30.67,22.58 v30.89,22.8 | v53.77,10.75 53.8,10.72 J2.P2
  Bottom 0.152: v30.89,22.8 30.89,24.42 33.74,27.27 33.74,29.37 36.61,32.23 49.35,32.23 55.1,26.48 55.1,12.08 v53.77,10.75
SWCLK
  Top 0.152: IC1.76 44.77,14.08 52.9,5.95 56.8,5.95 58.78,3.96 DEBUG.1
SWDIO  (via drill 0.35)
  Top 0.152: v38.84,2.31 38.84,4.77 39.51,5.43 IC1.72
  Bottom 0.152: v38.84,2.31 38.84,1.54 39.61,0.77 54.51,0.77 56.24,2.51 DEBUG.2
USART_RX  (via drill 0.35)
  Top 0.152: IC1.93 42.81,22.65 44.9,22.65 46.12,23.86 50.35,23.86 v50.54,23.68
  Bottom 0.152: v50.54,23.68 50.54,6.61 DEBUG.3
USART_TX  (via drill 0.35)
  Top 0.152: IC1.92 43.67,22.08 43.78,22.19 44.97,22.19 46.46,20.7 46.73,20.7 47.37,20.05 v47.64,20.05
  Bottom 0.152: DEBUG.4 49.91,4.7 49.91,17.79 v47.64,20.05
VCC  (via drill 0.35)  (13 unrouted)
  Top 0.152: LED5.4 77.07,34.78 v77.05,34.8 | LED4.4 v77.06,38.2 | LED3.4 v77.05,41.6 | LED6.4 77.04,31.34 v77.01,31.31 | LED7.4 77.11,27.91 v77.06,27.86 | LED9.4 77.08,21.03 v77.07,21.04 | LED8.4 77.06,24.47 v77.04,24.48 | LED10.4 v77.06,17.56 | v77.06,17.56
  Top 0.305: PCMCIA.51 v4.36,21.45 | IC2.3 72.28,34.49 v70.42,34.49 | C1.1 72.05,37.19 v72.06,37.18 | C10.1 v17.5,1.7 | C11.1 9.58,33.59 v9.3,33.31 | C2.1 46,40.47 v46.04,40.5
  Bottom 0.305: v4.36,21.45 PCMCIA.51
  pour PWR (isolate 0.254, rank 2): 0,44.52 0,0 80.41,0 80.41,44.52
VCC33  (via drill 0.35)
  Top 0.152: RN1.8 RN1.7 RN1.6 RN1.5 v61.31,18.25 | J2.P4 v65.75,8.52 v65.75,8.51 | 41.88,10.2 v41.87,10.21 | IC1.28 28.27,25.08 v28.61,25.42
  Top 0.203: IC1.100 43.86,26.08 v44.01,26.24
  Top 0.254: IC1.11 36.01,28.96 v35.75,29.21 | IC1.21 31.01,28.84 v30.62,29.23 | IC1.75 v41.52,12.34 | IC1.22 30.51,26.56 v30.27,26.33 | IC1.6 v38.51,26.52 v38.5,26.52 | C12.1 61.69,6.22 v62.69,6.22 | R3.1 15.79,22.31 v15.76,22.33 | R2.1 15.8,24.36 v15.76,24.32 | C17.1 v31.42,30.62 v31.43,30.61 | C18.1 36.42,30.07 v36.39,30.09 | C5.1 27.25,16.1 IC1.46 28.48,16.08 v28.81,16.41 | C16.1 26.91,9.42 v27.93,9.42
  Top 0.305: IC2.TAB v67.75,32.24 v69.19,32.24 v69.2,32.23 IC2.2 | C7.1 26.7,27.55 v27.32,26.93 | v45.7,22.46 46.84,22.46 C9.1 | C6.1 44.67,28.51 v45.35,27.83 | C3.1 v66.56,27.38 | R1.1 53.74,36.67 v53.7,36.63 | C8.1 41.88,10.2 | v41.52,12.34 v41.53,12.34
  pour PWR (isolate 0.305): 25.24,38.58 35.77,38.58 35.79,38.61 64.36,38.61 69.7,33.27 69.7,4.93 67.48,2.72 31.29,2.72 15.21,18.81 15.21,28.55
VDD18
  Top 0.254: IC1.48 25.85,15.08 24.87,14.1 C13.1 24.87,12.48 C14.1
VDDK
  Top 0.254: C4.1 26.02,19.08 | 26.02,19.08 IC1.40 | C15.1 25.48,19.08 26.02,19.08
WP/!IOCS16  (via drill 0.35)
  Top 0.152: PCMCIA.33 5.7,41.77 5.84,41.64 7.13,41.64 v7.38,41.89 | IC1.69 37.94,12.41 37.94,13.2 36.12,15.01 v30.37,15.01
  Bottom 0.152: v7.38,41.89 17.52,41.89 23.53,35.88 23.53,24.24 30.35,17.41 30.35,15.03 v30.37,15.01

### Text on the board
tNames: (C) 2026 - S.J. Leary, A. Makarenko & E. Hemming | TFPCMCIA h0TFmeister / Rev 1